# Altium schematic sheet N_Shift.SchDoc
size E
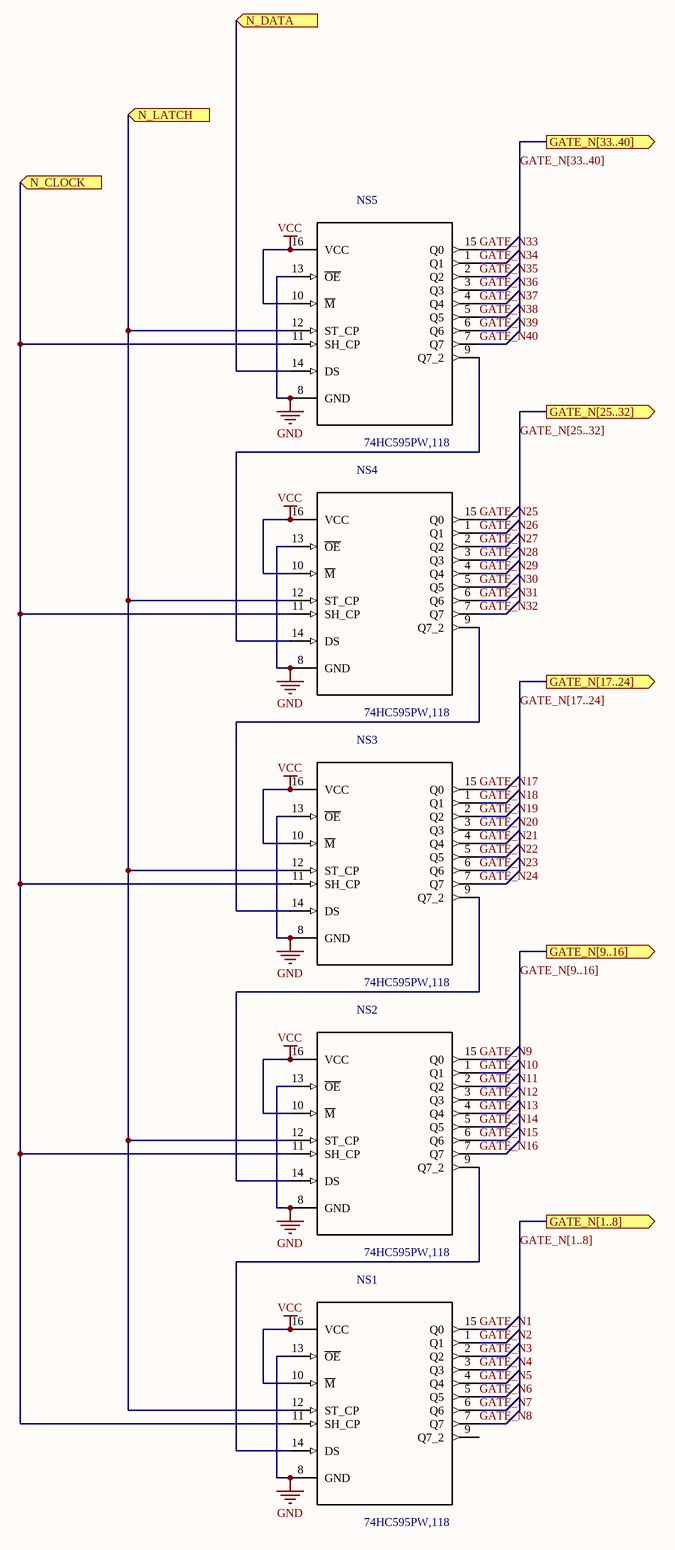
[diagram p0: N_Shift.SchDoc]

## Parts
NS1  74HC595PW,118  [SOP65P640X110-16N]
NS2  74HC595PW,118  [SOP65P640X110-16N]
NS3  74HC595PW,118  [SOP65P640X110-16N]
NS4  74HC595PW,118  [SOP65P640X110-16N]
NS5  74HC595PW,118  [SOP65P640X110-16N]

## Ports
GATE_N[1..8] (out), GATE_N[9..16] (out), GATE_N[17..24] (out), GATE_N[25..32] (out), GATE_N[33..40] (out), N_CLOCK (in), N_DATA (in), N_LATCH (in)

## Nets
GND: NS1.8(GND) NS1.13(~{OE}) NS2.8(GND) NS2.13(~{OE}) NS3.8(GND) NS3.13(~{OE}) NS4.8(GND) NS4.13(~{OE}) NS5.8(GND) NS5.13(~{OE})
VCC: NS1.10(M~{}) NS1.16(VCC) NS2.10(M~{}) NS2.16(VCC) NS3.10(M~{}) NS3.16(VCC) NS4.10(M~{}) NS4.16(VCC) NS5.10(M~{}) NS5.16(VCC)
GATE_N1: NS1.15(Q0)
GATE_N2: NS1.1(Q1)
GATE_N3: NS1.2(Q2)
GATE_N4: NS1.3(Q3)
GATE_N5: NS1.4(Q4)
GATE_N6: NS1.5(Q5)
GATE_N7: NS1.6(Q6)
GATE_N8: NS1.7(Q7)
GATE_N9: NS2.15(Q0)
GATE_N10: NS2.1(Q1)
GATE_N11: NS2.2(Q2)
GATE_N12: NS2.3(Q3)
GATE_N13: NS2.4(Q4)
GATE_N14: NS2.5(Q5)
GATE_N15: NS2.6(Q6)
GATE_N16: NS2.7(Q7)
GATE_N17: NS3.15(Q0)
GATE_N18: NS3.1(Q1)
GATE_N19: NS3.2(Q2)
GATE_N20: NS3.3(Q3)
GATE_N21: NS3.4(Q4)
GATE_N22: NS3.5(Q5)
GATE_N23: NS3.6(Q6)
GATE_N24: NS3.7(Q7)
GATE_N25: NS4.15(Q0)
GATE_N26: NS4.1(Q1)
GATE_N27: NS4.2(Q2)
GATE_N28: NS4.3(Q3)
GATE_N29: NS4.4(Q4)
GATE_N30: NS4.5(Q5)
GATE_N31: NS4.6(Q6)
GATE_N32: NS4.7(Q7)
GATE_N33: NS5.15(Q0)
GATE_N34: NS5.1(Q1)
GATE_N35: NS5.2(Q2)
GATE_N36: NS5.3(Q3)
GATE_N37: NS5.4(Q4)
GATE_N38: NS5.5(Q5)
GATE_N39: NS5.6(Q6)
GATE_N40: NS5.7(Q7)
N_CLOCK: NS1.11(SH_CP) NS2.11(SH_CP) NS3.11(SH_CP) NS4.11(SH_CP) NS5.11(SH_CP) ; port N_CLOCK
N_DATA: NS5.14(DS) ; port N_DATA
N_LATCH: NS1.12(ST_CP) NS2.12(ST_CP) NS3.12(ST_CP) NS4.12(ST_CP) NS5.12(ST_CP) ; port N_LATCH
NetNS1_14: NS1.14(DS) NS2.9(Q7_2)
NetNS2_14: NS2.14(DS) NS3.9(Q7_2)
NetNS3_14: NS3.14(DS) NS4.9(Q7_2)
NetNS4_14: NS4.14(DS) NS5.9(Q7_2)

Not connected (* = marked no-connect by the designer): NS1 9(Q7_2)

## Buses and harness runs
bus GATE_N[1..8] = port GATE_N[1..8]
bus GATE_N[9..16] = port GATE_N[9..16]
bus GATE_N[17..24] = port GATE_N[17..24]
bus GATE_N[25..32] = port GATE_N[25..32]
bus GATE_N[33..40] = port GATE_N[33..40]

## Library data of the parts
NS1-NS5 = 74HC595PW,118: 8-bit serial-in%2C serial or parallel-out shift register with output latches%3B 3-state; MF: NXP Semiconductors; MP: 74HC595PW,118; Price: 0.17 USD; Availability: Good; Package: TSSOP-16 NXP Semiconductors; Value: *